# EAGLE design Adafruit ESP32-S3 Reverse TFT (EAGLE 9.6.2)
COMPANY: ADAFRUIT INDUSTRIES; DRAWN: KTOWN; REV: B
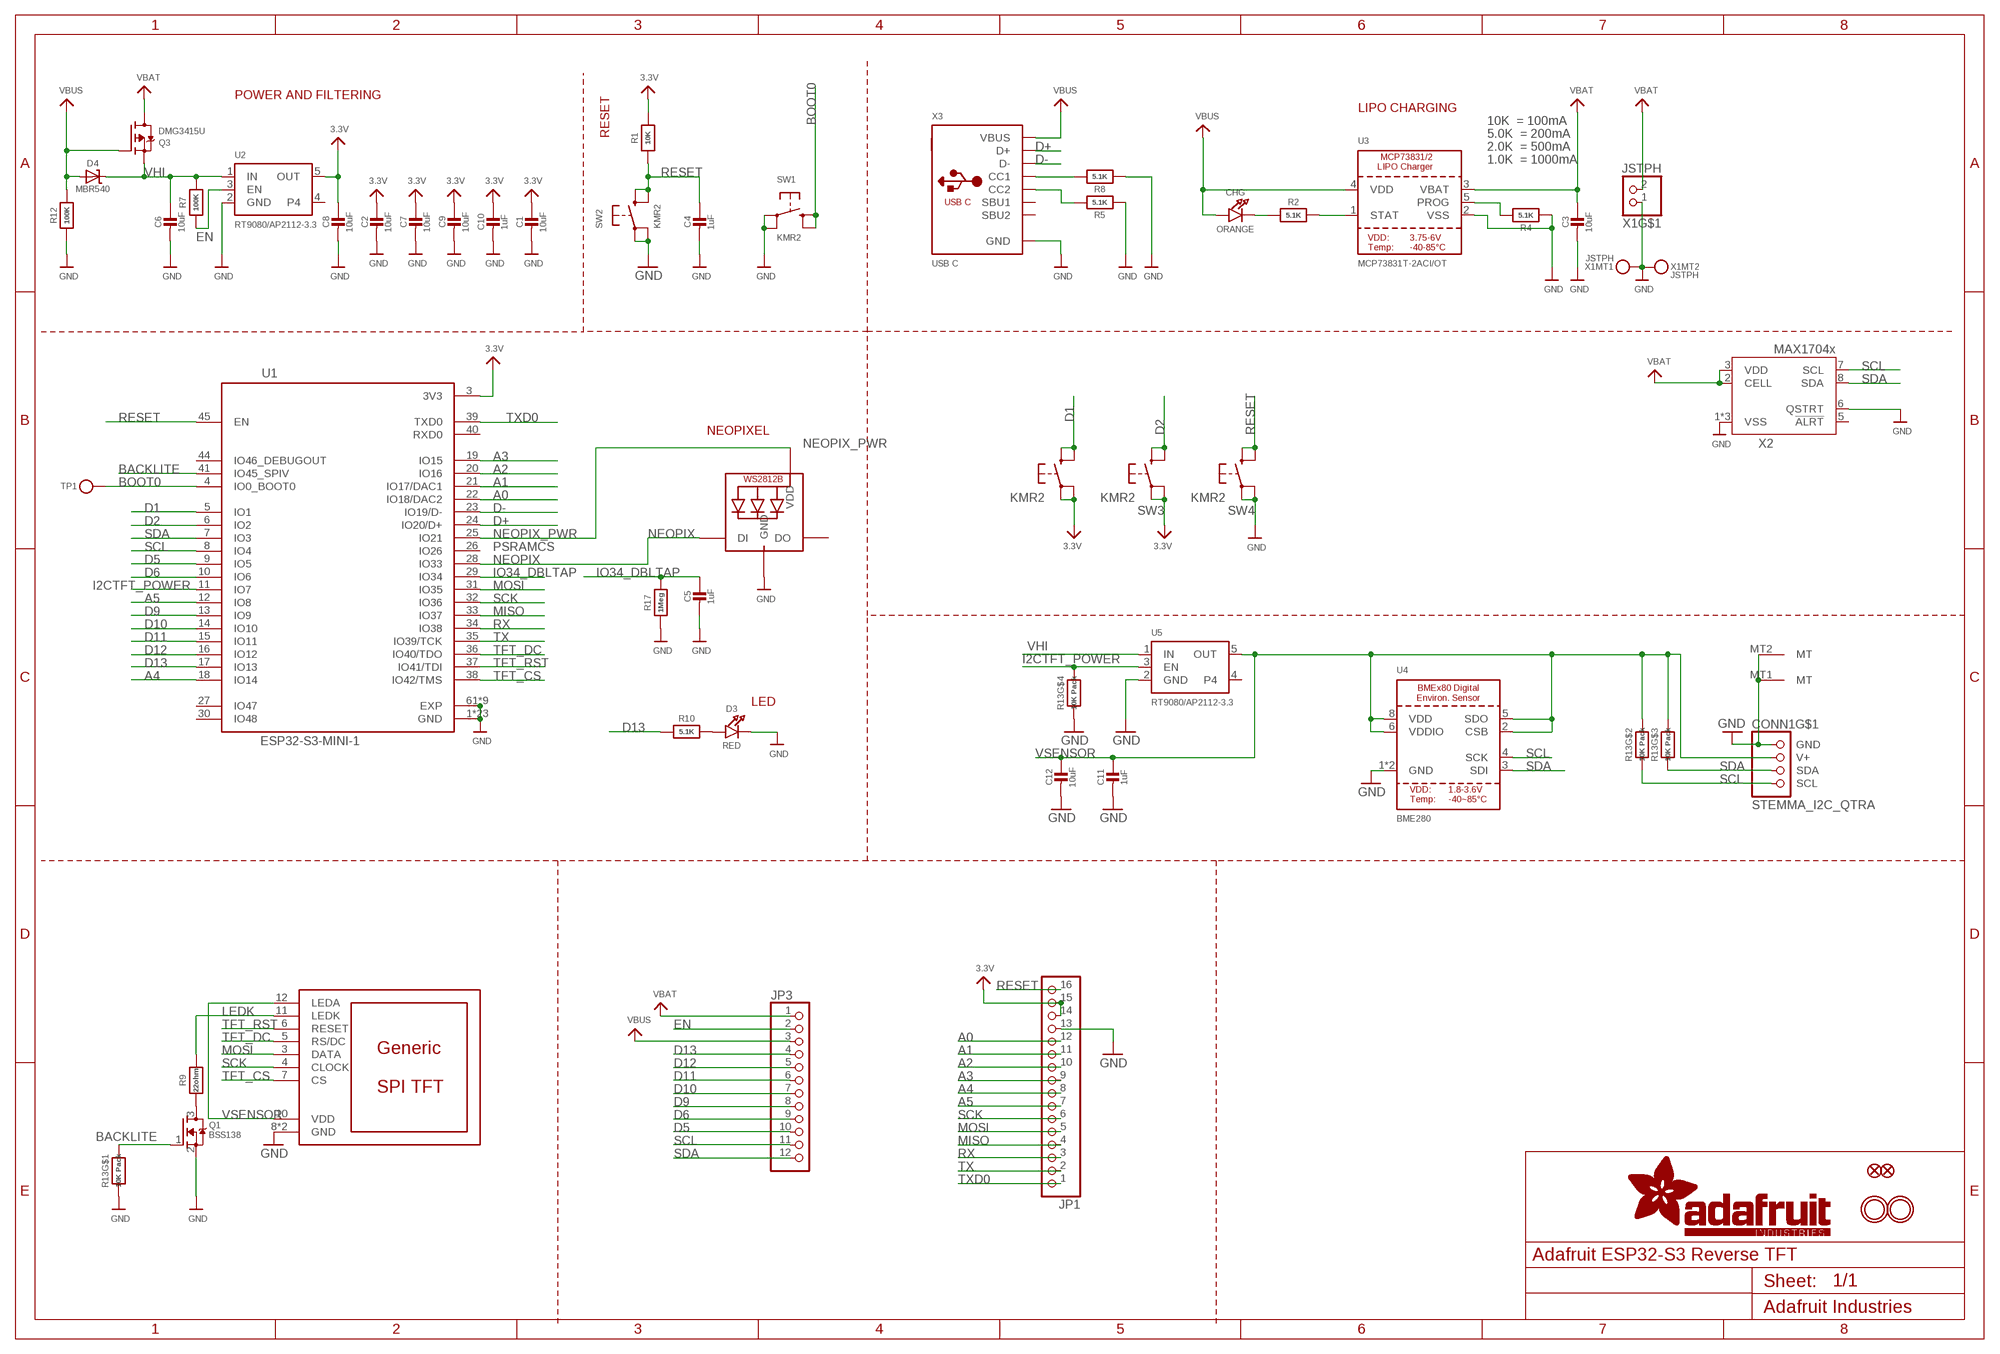
[diagram p0: schematic, sheet 1]

## Parts
C1  10uF  CAP_CERAMIC0805-NOOUTLINE  [0805-NO]
C2  10uF  CAP_CERAMIC0805-NOOUTLINE  [0805-NO]
C3  10uF  CAP_CERAMIC0805-NOOUTLINE  [0805-NO]
C4  1uF  CAP_CERAMIC0603_NO  [0603-NO]
C5  1uF  CAP_CERAMIC0603_NO  [0603-NO]
C6  10uF  CAP_CERAMIC0805-NOOUTLINE  [0805-NO]
C7  10uF  CAP_CERAMIC0805-NOOUTLINE  [0805-NO]
C8  10uF  CAP_CERAMIC0805-NOOUTLINE  [0805-NO]
C9  10uF  CAP_CERAMIC0805-NOOUTLINE  [0805-NO]
C10  1uF  CAP_CERAMIC0603_NO  [0603-NO]
C11  1uF  CAP_CERAMIC0603_NO  [0603-NO]
C12  10uF  CAP_CERAMIC0805-NOOUTLINE  [0805-NO]
CHG  ORANGE  LED0603_NOOUTLINE  [CHIPLED_0603_NOOUTLINE]
CONN1  STEMMA_I2C_QTRA  [JST_SH4_RA]
D3  RED  LED0603_NOOUTLINE  [CHIPLED_0603_NOOUTLINE]
D4  MBR540  DIODE-SCHOTTKYSOD-123  [SOD-123]
DISP1  DISP_LCD_GENERIC_SPI_1.14IN_240X135_WRAPUNDER  [TFT_1.14IN_240X135_WRAPUNDER]
JP1  HEADER-1X16_MIN  [1X16_ROUND_MIN]
JP3  HEADER-1X12_MIN  [1X12_ROUND_MIN]
LED1  WS2812B_SK6805_1515  [SK6805_1515]
Q1  BSS138  MOSFET-N_SC70  [SC70]
Q3  DMG3415U  MOSFET-P  [SOT23-R]
R1  10K  RESISTOR_0603_NOOUT  [0603-NO]
R2  5.1K  RESISTOR_0603_NOOUT  [0603-NO]
R4  5.1K  RESISTOR_0603_NOOUT  [0603-NO]
R5  5.1K  RESISTOR_0603_NOOUT  [0603-NO]
R7  100K  RESISTOR_0603_NOOUT  [0603-NO]
R8  5.1K  RESISTOR_0603_NOOUT  [0603-NO]
R9  22ohm  RESISTOR_0603_NOOUT  [0603-NO]
R10  5.1K  RESISTOR_0603_NOOUT  [0603-NO]
R12  100K  RESISTOR_0603_NOOUT  [0603-NO]
R13  10K Pack  RESISTOR_4PACK  [RESPACK_4X0603]
R17  1Meg  RESISTOR_0603_NOOUT  [0603-NO]
SW1  KMR2  SWITCH_TACT_SMT_RKB2  [BTN_RKB2_4.6X2.8]
SW2  KMR2  SWITCH_TACT_SMT_RKB2  [BTN_RKB2_4.6X2.8]
SW3  KMR2  SWITCH_TACT_SMT_RKB2  [BTN_RKB2_4.6X2.8]
SW4  KMR2  SWITCH_TACT_SMT_RKB2  [BTN_RKB2_4.6X2.8]
SW5  KMR2  SWITCH_TACT_SMT_RKB2  [BTN_RKB2_4.6X2.8]
TP1  TESTPOINTROUND1.5MMNO  [TESTPOINT_ROUND_1.5MM_NO]
U1  ESP32-S3-MINI-1  [ESP32-S2-MINI-1]
U2  RT9080/AP2112-3.3  VREG_SOT23-5  [SOT23-5]
U3  MCP73831T-2ACI/OT  MCP73831/2  [SOT23-5]
U4  BME280  [BME280]
U5  RT9080/AP2112-3.3  VREG_SOT23-5  [SOT23-5]
U$31  MOUNTINGHOLE2.5  [MOUNTINGHOLE_2.5_PLATED]
U$32  MOUNTINGHOLE2.5  [MOUNTINGHOLE_2.5_PLATED]
U$34  FIDUCIAL_1MM  [FIDUCIAL_1MM]
U$35  FIDUCIAL_1MM  [FIDUCIAL_1MM]
X1  JSTPH  CON_JST_PH_2PIN_MT_BATT  [JSTPH2_BATT]
X2  MAX17048/T  [TDFN8_2X2MM]
X3  USB C  USB_C  [USB_C_CUSB31-CFM2AX-01-X]

## Nets
3.3V: C1.1 C2.1 C7.1 C8.1 C9.1 C10.1 JP1.14 JP1.15 R1.2 SW3.A'(P1) SW3.A(P) SW5.A'(P1) SW5.A(P) U1.3(3V3) U2.5(OUT)
A0: JP1.12 U1.22(IO18/DAC2)
A1: JP1.11 U1.21(IO17/DAC1)
A2: JP1.10 U1.20(IO16)
A3: JP1.9 U1.19(IO15)
A4: JP1.8 U1.18(IO14)
A5: JP1.7 U1.12(IO8)
BACKLITE: Q1.1(G) R13.8 U1.41(IO45_SPIV)
BOOT0: SW1.B'(S1) SW1.B(S) TP1.P$1 U1.4(IO0_BOOT0)
D1: SW5.B'(S1) SW5.B(S) U1.5(IO1)
D2: SW3.B'(S1) SW3.B(S) U1.6(IO2)
D5: JP3.10 U1.9(IO5)
D6: JP3.9 U1.10(IO6)
D9: JP3.8 U1.13(IO9)
D10: JP3.7 U1.14(IO10)
D11: JP3.6 U1.15(IO11)
D12: JP3.5 U1.16(IO12)
D13: JP3.4 R10.1 U1.17(IO13)
D+: U1.24(IO20/D+) X3.A6(D+) X3.B6(D+)
D-: U1.23(IO19/D-) X3.A7(D-) X3.B7(D-)
EN: JP3.2 R7.1 U2.3(EN)
GND: C1.2 C2.2 C3.2 C4.2 C5.2 C6.2 C7.2 C8.2 C9.2 C10.2 C11.2 C12.2 CONN1.1(GND) CONN1.MT1(MT) CONN1.MT2(MT) D3.C DISP1.8(GND) DISP1.13(GND) JP1.13 LED1.4(GND) Q1.2(S) R4.1 R5.1 R8.1 R12.1 R13.1 R13.4 R17.1 SW1.A'(P1) SW1.A(P) SW2.A'(P1) SW2.A(P) SW4.A'(P1) SW4.A(P) U1.1(GND) U1.2(GND) U1.42(GND) U1.43(GND) U1.46(GND) U1.47(GND) U1.48(GND) U1.49(GND) U1.50(GND) U1.51(GND) U1.52(GND) U1.53(GND) U1.54(GND) U1.55(GND) U1.56(GND) U1.57(GND) U1.58(GND) U1.59(GND) U1.60(GND) U1.61(EXP) U1.62(GND) U1.63(GND) U1.64(GND) U1.65(GND) U1.66(EXP) U1.67(EXP) U1.68(EXP) U1.69(EXP) U1.70(EXP) U1.71(EXP) U1.72(EXP) U1.73(EXP) U2.2(GND) U3.2(VSS) U4.1(GND) U4.7(GND) U5.2(GND) X1.1 X1.NC1 X1.NC2 X2.1(VSS) X2.4(VSS) X2.6(QSTRT) X2.THERMAL(VSS) X3.A1B12(GND) X3.B1A12(GND)
I2CTFT_POWER: R13.5 U1.11(IO7) U5.3(EN)
IO34_DBLTAP: C5.1 R17.2 U1.29(IO34)
LEDK: DISP1.11(LEDK) R9.2
MISO: JP1.4 U1.33(IO37)
MOSI: DISP1.3(DATA) JP1.5 U1.31(IO35)
N$1: CHG.C R2.1
N$2: Q1.3(D) R9.1
N$3: R2.2 U3.1(STAT)
N$4: R4.2 U3.5(PROG)
N$5: D3.A R10.2
N$8: R8.2 X3.A5(CC1)
N$9: R5.2 X3.B5(CC2)
NEOPIX: LED1.1(DI) U1.28(IO33)
NEOPIX_PWR: LED1.2(VDD) U1.25(IO21)
RESET: C4.1 JP1.16 R1.1 SW2.B'(S1) SW2.B(S) SW4.B'(S1) SW4.B(S) U1.45(EN)
RX: JP1.3 U1.34(IO38)
SCK: DISP1.4(CLOCK) JP1.6 U1.32(IO36)
SCL: CONN1.4(SCL) JP3.11 R13.2 U1.8(IO4) U4.4(SCK) X2.7(SCL)
SDA: CONN1.3(SDA) JP3.12 R13.3 U1.7(IO3) U4.3(SDI) X2.8(SDA)
TFT_CS: DISP1.7(CS) U1.38(IO42/TMS)
TFT_DC: DISP1.5(RS/DC) U1.36(IO40/TDO)
TFT_RST: DISP1.6(RESET) U1.37(IO41/TDI)
TX: JP1.2 U1.35(IO39/TCK)
TXD0: JP1.1 U1.39(TXD0)
VBAT: C3.1 JP3.1 Q3.3(D) U3.3(VBAT) X1.2 X2.2(CELL) X2.3(VDD)
VBUS: CHG.A D4.A JP3.3 Q3.1(G) R12.2 U3.4(VDD) X3.A4B9(VBUS) X3.B4A9(VBUS)
VHI: C6.1 D4.C Q3.2(S) R7.2 U2.1(IN) U5.1(IN)
VSENSOR [Power]: C11.1 C12.1 CONN1.2(V+) DISP1.10(VDD) DISP1.12(LEDA) R13.6 R13.7 U4.2(CSB) U4.5(SDO) U4.6(VDDIO) U4.8(VDD) U5.5(OUT)
Unconnected: LED1.3(DO) U1.26(IO26) U1.27(IO47) U1.30(IO48) U1.40(RXD0) U1.44(IO46_DEBUGOUT) U2.4 U5.4 X2.5(!ALRT) X3.A8(SBU1) X3.B8(SBU2)

## Notes on the sheet
- POWER AND FILTERING
- LIPO CHARGING
- 10K  = 100mA
- RESET | 5.0K  = 200mA
- 2.0K  = 500mA
- 1.0K  = 1000mA
- NEOPIXEL
- PSRAMCS
- LED

## Library data of the parts
C1-C12 = microbuilder:CAP_CERAMIC: Ceramic Capacitors For new designs, use the packages preceded by an '_' character since they are more reliable: The following footprints should be used on most boards: _0402 - Standard footprint for regular board layouts _0603 - Standard footprint for regular board layouts _0805 - Standard footprint for regular board layouts _1206 - Standard footprint for regular board layouts For extremely tight-pitch boards where space is at a premium, the following 'micro-pitch' footprints can be used (smaller pads, no silkscreen outline, etc.): _0402MP - Micro-pitch footprint for very dense/compact boards _0603MP - Micro-pitch footprint for very dense/compact boards _0805MP - Micro-pitch footprint for very dense/compact boards _1206MP - Micro-pitch footprint for very dense/compact boards
CHG D3 = microbuilder:LED: LED 0603 - 0603 Surface Mount Package 2mA: Green LED - Low Power (3.9mcd, 2ma, 1.7Vf) - Digikey: 475-2709-2-ND Orange LED - Low Power (9.8mcd, 2ma, 1.8Vf) - Digikey: 475-1194-2-ND Red LED - Low Power (5mcd, 2ma, 1.8Vf) - Digikey: 475-1195-2-ND Yellow LED - Low Power (7mcd, 2ma, 1.8Vf) - Digikey: 475-1196-2-ND 5mA: Blue LED - Low Power (17mcd, 5ma, 2.9Vf) - Digikey: LNJ937W8CRACT-ND 0805 - 0805 Surface Mount Package 2mA: Red LED (8.8mcd, 2mA, 1.8Vf, Clear) - Low Power [Digikey: 475-2510-1-ND] Green LED (5mcd, 2mA, 1.8Vf, Clear) - Low Power [Digikey: 475-2730-1-ND] Yellow LED (11.3mcd, 2mA, 1.8Vf, Clear) - Low Power [Digikey: 475-2555-1-ND] 20mA: Red LED (104mcd, 20mA, Diffused) - LS R976 [Digikey: 475-1278-6-ND] Red LED (12mcd, 20mA, 2.0Vf, Clear) - APT2012EC [Digikey: 754-1128-1-ND] Green LED (15mcd, 20mA, 2.2Vf, Clear) - APT2012GC [Digikey: 754-1131-1-ND] Orange LED (160mcd, 20mA, 2.1Vf, Clear) - APT2012SECK [Digikey: 754-1130-1-ND] 1206 - 1206 Surface Mount Package Green LED (26mcd, 20mA, Diffused) - LG N971 [Digikey: 475-1407-6-ND] Red LED (15mcd, 20mA, Diffused) - LH N974 [Digikey: 475-1416-6-ND] Cree - Cree High-Power Surface Mount LEDs XPEBWT-L1-0000-00D50 - White 111lm 350mA 2.9Vf 6200K 110° XTEAWT-00-0000-00000LEE3 - White 114lm 350mA 2.85Vf 5000K 115° Everlight - Everlight 45-21 Series Surface Mount LEDs 45-21/QK2C-B2832AC2CB2/2T - Warm White 2000mcd 20mA 3.25Vf 3050K 120° 45-21/LK2C-B38452C4CB2/2T - Nuetral White 2000mcd 20mA 3.25Vf 4150K 120° 45-21/LK2C-B50634C6CB2/2T - Cold White 2200mcd 20mA 3.25Vf 5650K 120° PLCC2 Reverse Mount LS T77K-J1L2-1-0-2-R18-Z - Red 11.25mcd 2mA 1.8Vf 630nm 120° LO T77K-L1M2-24-Z - Orange 19.6mcd 2mA 1.8Vf 606nm 120° LY T77K-K2M1-26-Z - Yellow 15.7mcd 2mA 1.8Vf 587nm 120°; ROT: 270
CONN1 = adafruit_electromech:STEMMA_I2C; LCSC: C145961
D4 = microbuilder:DIODE-SCHOTTKY
DISP1 = adafruit_display:DISP_LCD_GENERIC_SPI
JP1 = microbuilder:HEADER-1X16: PIN HEADER
JP3 = microbuilder:HEADER-1X12
LED1 = microbuilder:WS2812B; LCSC: C2890035
Q1 = microbuilder:MOSFET-N: N-Channel Mosfet LEGEND VDS: Voltage Drain-Source ID: Drain Current RDS(ON): Drain-Source On-State Resistance VGS(TH): Gate-Source Threshold Voltage CISS: Drain-Source Input Capacitance SOT-23 Name VDS ID RDS(ON) VGS(TH) CISS Order Number 2N7002E 60V 260mA 2.5 Ohm 2.5V @ 250uA 26.7pF @ 25V 2N7002ET1GOSTR-ND BSH103 30V 850mA 400 mOhm 400mV @ 1mA 83pF @ 24V BSH103,235-ND BSS138 60V 320mA 1.6 Ohm 1.5V @ 250uA 50pF @ 10V Mouser: 771-BSS138PW115 DMN2075U-7 20V 4.2A 38 mOhm 1V @ 250 uA 594.3pF @ 10V DMN2075U-7DICT-ND * BSS138 good choice for I2C level-shifting POWERPAK 1212-8 Name VDS ID RDS(ON) VGS(TH) CISS Order Number Si7308DN 60V 6A 58 mOhm 3V @ 250uA 665pF @ 15V SI7308DN-T1-E3CT-ND
Q3 = microbuilder:MOSFET-P: P-Channel Mosfet LEGEND VDS: Voltage Drain-Source ID: Drain Current RDS(ON): Drain-Source On-State Resistance VGS(TH): Gate-Source Threshold Voltage CISS: Drain-Source Input Capacitance SOT-23 Name VDS ID RDS(ON) VGS(TH) CISS Order Number IRLML5103 30V 760mA 600 mOhm -- 75pF @ 25V Digikey: IRLML5103PBFCT-ND IRLML6401 12V 4.3A 50 mOhm 950mV @ 250µA 830pF @ 10V Digikey: IRLML6401PBFTR-ND NTR0202PL 20V 400mA 800 mOhm 2.3V @ 250uA 70pF @ 5V Digikey: NTR0202PLT1GOSTR-ND NTR4101PT1G 20V 1.8A 85 mOhm 1.2V @ 250uA 675pF @ 10V Digikey: NTR4101PT1GOSCT-ND DMP2004K 20V 600mA 900 mOhm 1V @ 250uA 175pF @ 16V Digikey: DMP2004KDICT-ND PMV65XP 20V 3.9A 76 mOhm 950mV @ 1mA 725pF @ 20V Digikey: 568-2358-2-ND TO-252 Name VDS ID RDS(ON) VGS(TH) CISS Order Number AOD417 30V 25A 34 mOhm 3V @ 250µA 920pF @ 15V Digikey: 785-1106-2-ND PowerPak Name VDS ID RDS(ON) VGS(TH) CISS Order Number AON7401 30V 12A 14 mOhm 3V @ 250µA 2600pF @ 15V Digikey: 785-1302-1-ND
R1 R2 R4 R5 R7-R10 R12 R17 = microbuilder:RESISTOR: Resistors For new designs, use the packages preceded by an '_' character since they are more reliable: The following footprints should be used on most boards: _0402 - Standard footprint for regular board layouts _0603 - Standard footprint for regular board layouts _0805 - Standard footprint for regular board layouts _1206 - Standard footprint for regular board layouts For extremely tight-pitch boards where space is at a premium, the following 'micro-pitch' footprints can be used (smaller pads, no silkscreen outline, etc.): _0402MP - Micro-pitch footprint for very dense/compact boards _0603MP - Micro-pitch footprint for very dense/compact boards _0805MP - Micro-pitch footprint for very dense/compact boards _1206MP - Micro-pitch footprint for very dense/compact boards
R13 = microbuilder:RESISTOR_4PACK: Resistor Packs (4 resistors) 4 x 0603 10K 1/16W - Digikey: YC164J-10KCT-ND
SW1-SW5 = adafruit_electromech:SWITCH_TACT_SMT: SMT Tact Switches RKB2 https://www.digikey.com/short/m027prz5
TP1 = microbuilder:TESTPOINT: Test Point Various test points for characterisation and PCB testing TESTPOINT_SMT - Compact Surface Mount Test Point [Digikey: 5016KTR-ND]
U1 = adafruit_wireless:ESP32-S3-MINI-1; BUILT_BY: EMA_Kyle; COPYRIGHT: Copyright (C) 2018 Accelerated Designs. All rights reserved; DATASHEET: https://www.espressif.com/sites/default/files/documentation/esp32-s2-mini-1_esp32-s2-mini-1u_datasheet_en.pdf; MANUFACTURER_PART_NUMBER: ESP32-S2-MINI-1; SOURCELIBRARY: Add_to_database_2020-11-03; VENDOR: Espressif Systems
U2 U5 = adafruit_power:VREG_SOT23-5: SOT23-5 Fixed Voltage Regulators Part Current Out V Out V In V Dropout θJA (°C/W) TJ (°C) Digikey Part No. ADP121 150mA 3.3V 3.4-5.5V 0.09V @ 150mA -- -- ADP121-AUJZ33R7CT-ND ADP121 150mA 3.0V 3.1-5.5V 0.09V @ 150mA -- -- ADP121-AUJZ30R7CT-ND ADP122 300mA 3.3V 3.4-5.5V 0.085V @ 300mA -- -- ADP122AUJZ-3.3-R7CT-ND ADP1712 300mA 3.3V 3.5-5.5V 0.17V @ 300mA -- -- ADP1712AUJZ-3.3-R7TR-ND AP7311 (Low Cost) 150mA 3.3V 3.5-6V 0.15V @ 150mA -- -- AP7311-33WG-7DICT-ND LD39015M18R 150mA 1.8V 1.9V-5.5V 0.08V @ 100mA -- -- 497-6977-1-ND LP2985A-33DBVR 150mA 3.3V 3.3-16V 0.28V @ 150mA 206 150 296-18479-1-ND MCP1824T-3302E/OT 300mA 3.3V 3.5V-6V 0.2V @ 300mA -- -- MCP1824T-3302E/OTCT-ND MIC5205-2.5YM5 TR 150mA 2.5V 2.7-16V 0.165V @ 150mA -- -- 576-1257-2-ND MIC5205-3.0YM5 TR 150mA 3.0V 3.2V-16V 0.165V @ 150mA -- -- 576-1258-2-ND MIC5205-3.3YM5 TR 150mA 3.3V 3.5V-16V 0.165V @ 150mA -- -- 576-1259-2-ND TPS780330220 150mA 3.3V+2.2V 3.6-5.5V 250mV Max -- -- 296-23332-1-ND TDA3663/N1,135 100mA 3.3V 3.5-45V 0.18V @ 50mA -- -- 568-5343-1-ND Max operating temp can be calculated using θJA, TJ (max junction temperature), and power in watts. Set the "Maximum Ambient Temperature" until it reaches TJ ("Max Junction Temperature"), which is the absolute limit for safe use of the regulator: Heat Sink Temperature Calculator <http://www.daycounter.com/Calculators/Heat-Sink-Temperature-Calculator.phtml> For example, With 12V source into a 3.3V LP2985 and a 30mA load, we are dissipating (12V-3.3V) * 0.03A = 0.261W. With a θJA of 206 °C/W, a TJ of 150°C, and 261mW we can safely use the chip without a heat sink up to 75°C (=147.1°C Junction Temperature).; JLC_ROTATION: 0
U3 = microbuilder:MCP73831/2: MCP73831/2 LIPO Charger VDD: 3.75 - 6V Temp -40 - 85°C Programmable Charge Rate: 15-500mA NOTE: STAT is a tri-state logic output on the MCP73831 and an open-drain output on the MCP73832. SOT23-5 with 4.2V output and tri-state logic on STAT = MCP73831T-2ACI/OT; JLC_ROTATION: 270; LCSC: C424093
U4 = adafruit_sensor:BME280: BME280 - Environmental Sensor (I2C + SPI); ROT: 180
U$31 U$32 = adafruit_electromech:MOUNTINGHOLE: Mounting Hole For #2 screws (0.086"/2.18mm width, 0.094"/2.4mm hole) use 2.5mm; BOM: EXCLUDE
U$34 U$35 = microbuilder:FIDUCIAL: Fiducial Alignment Points Various fiducial points for machine vision alignment.; BOM: EXCLUDE
X1 = adafruit_electromech:CON_JST_PH_2PIN_MT; LCSC: C47647
X2 = adafruit_sensor:MAX17048; ROT: 270
X3 = adafruit_electromech:USB_C: USB Type-C USB 2.0 Connector; LCSC: C165948

## Net classes
2 gnd: width 0.254 mm, drill 0.483 mm
3 Power: width 0.305 mm, drill 0.483 mm

## Board
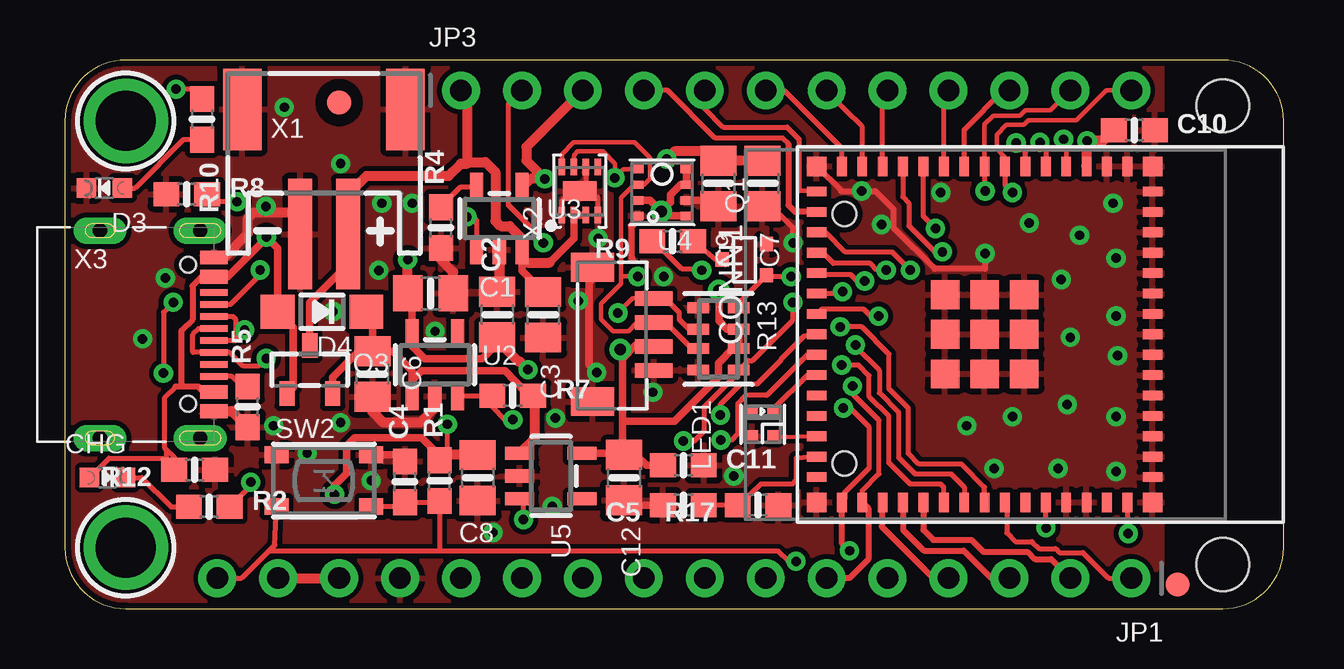
[diagram p1: board, top side]
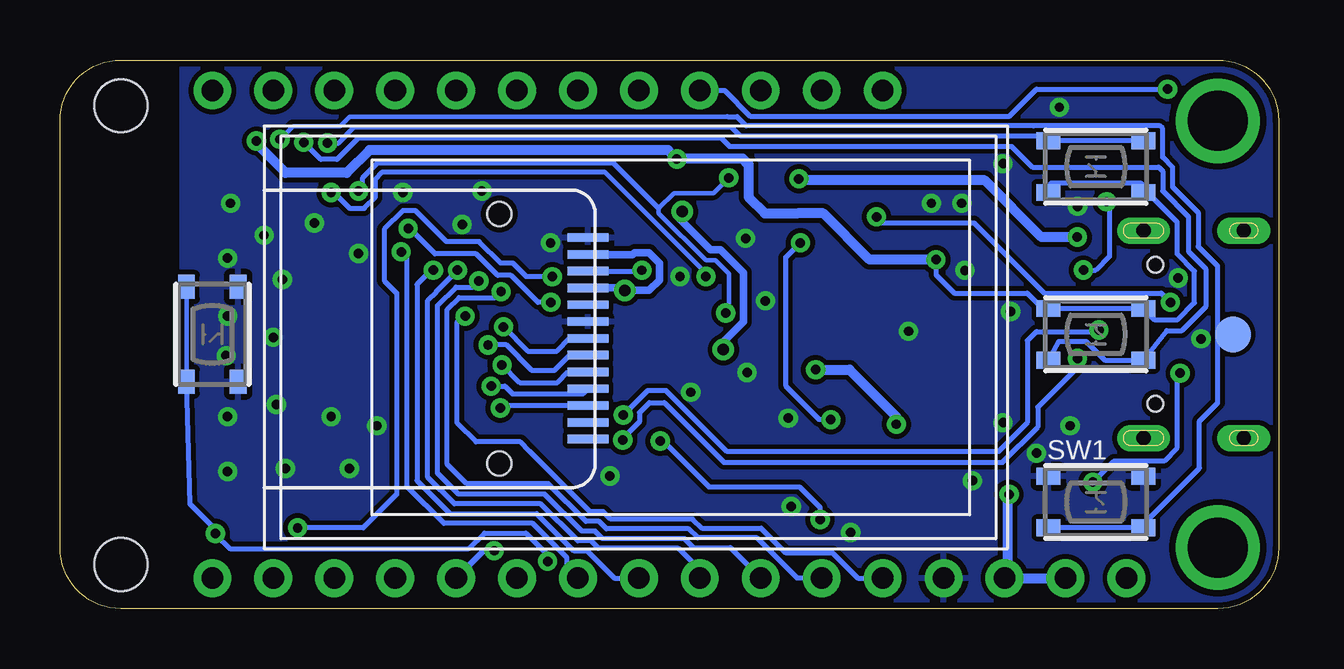
[diagram p2: board, bottom side, seen from below]

Size 50.8 x 22.86 mm. Coordinates in mm from the lower left corner, seen from the top.
Outline: 2.54,0 48.26,0 arc90 50.8,2.54 50.8,20.32 arc90 48.26,22.86 2.54,22.86 arc90 0,20.32 0,2.54 arc90 2.54,0
Copper layers (1*16): Top 0.035mm / dielectric 1.5mm / Bottom 0.035mm
Design rules "adafruit 7-7 *": minimum track width 6mil, minimum drill 15.5mil, track to track 8mil, track to pad 7mil, pad to pad 7mil, via to via 7mil, smd to smd 7mil, copper to edge 10mil, drill to drill 8mil, minimum pad ring 10mil, minimum via ring 8mil, stop-mask expansion 2mil, vias tented up to drill 20mil, thermal gap 10mil
Holes 2.2 mm at 48.26,1.84 48.26,20.95

### Footprints (pad centres in the part's own frame; a part is rotated, then mirrored left to right if it is on the bottom)
0805-NO = smd 1.24 x 1.5: 1 -0.95,0; 2 0.95,0
0603-NO = smd 1.075 x 1: 1 -0.85,0; 2 0.85,0
CHIPLED_0603_NOOUTLINE = smd 0.8 x 0.8: A 0,-0.75; C 0,0.75
JST_SH4_RA = smd 0.6 x 1.55: 1 1.5,0.924; 2 0.5,0.924; 3 -0.5,0.924; 4 -1.5,0.924 | smd 1.2 x 1.8: MT1 -2.8,-1.624; MT2 2.8,-1.624
SOD-123 = smd 1.4 x 1.4: A 1.85,0; C -1.85,0
TFT_1.14IN_240X135_WRAPUNDER = smd 0.35 x 1.7: 1 4.24,13.5; 2 3.54,13.5; 3 2.84,13.5; 4 2.14,13.5; 5 1.44,13.5; 6 0.74,13.5; 7 0.04,13.5; 8 -0.66,13.5; 9 -1.36,13.5; 10 -2.06,13.5; 11 -2.76,13.5; 12 -3.46,13.5; 13 -4.16,13.5 | hole 1: -5.14,9.8; 5.26,9.8
1X16_ROUND_MIN = drill 0.9 pad 1.575: 1 -19.05,0; 2 -16.51,0; 3 -13.97,0; 4 -11.43,0; 5 -8.89,0; 6 -6.35,0; 7 -3.81,0; 8 -1.27,0; 9 1.27,0; 10 3.81,0; 11 6.35,0; 12 8.89,0; 13 11.43,0; 14 13.97,0; 15 16.51,0; 16 19.05,0
1X12_ROUND_MIN = drill 0.9 pad 1.575: 1 -13.97,0; 2 -11.43,0; 3 -8.89,0; 4 -6.35,0; 5 -3.81,0; 6 -1.27,0; 7 1.27,0; 8 3.81,0; 9 6.35,0; 10 8.89,0; 11 11.43,0; 12 13.97,0
SK6805_1515 = smd 0.5 x 0.5: 1 -0.5,-0.45; 2 0.5,-0.45; 3 0.5,0.45; 4 -0.5,0.45
SC70 = smd 0.6 x 0.55: 1 -0.65,-0.925; 2 0.65,-0.925; 3 0,0.925
SOT23-R = smd 0.635 x 1.016: 1 -0.95,-1; 2 0.95,-1; 3 0,1
RESPACK_4X0603 = smd 0.45 x 0.9: 1 -1.3,-0.85; 2 -0.4,-0.85; 3 0.4,-0.85; 4 1.3,-0.85; 5 1.3,0.85; 6 0.4,0.85; 7 -0.4,0.85; 8 -1.3,0.85
BTN_RKB2_4.6X2.8 = smd 1 x 0.7: A 1.973,1.075; A' -1.973,1.075; B 1.973,-1.075; B' -1.973,-1.075
TESTPOINT_ROUND_1.5MM_NO = smd 1.5 x 1.5: P$1 0,0
ESP32-S2-MINI-1 = smd 0.813 x 0.406: 1 -7,5.931; 2 -7,5.081; 3 -7,4.231; 4 -7,3.381; 5 -7,2.531; 6 -7,1.681; 7 -7,0.831; 8 -7,-0.019; 9 -7,-0.869; 10 -7,-1.719; 11 -7,-2.569; 12 -7,-3.419; 13 -7,-4.269; 14 -7,-5.119; 15 -7,-5.969; 31 7,-5.969; 32 7,-5.119; 33 7,-4.269; 34 7,-3.419; 35 7,-2.569; 36 7,-1.719; 37 7,-0.869; 38 7,-0.019; 39 7,0.831; 40 7,1.681; 41 7,2.531; 42 7,3.381; 43 7,4.231; 44 7,5.081; 45 7,5.931 | smd 0.406 x 0.813: 16 -5.95,-7.019; 17 -5.1,-7.019; 18 -4.25,-7.019; 19 -3.4,-7.019; 20 -2.55,-7.019; 21 -1.7,-7.019; 22 -0.85,-7.019; 23 0,-7.019; 24 0.85,-7.019; 25 1.7,-7.019; 26 2.55,-7.019; 27 3.4,-7.019; 28 4.25,-7.019; 29 5.1,-7.019; 30 5.95,-7.019; 46 5.95,6.981; 47 5.1,6.981; 48 4.25,6.981; 49 3.4,6.981; 50 2.55,6.981; 51 1.7,6.981; 52 0.85,6.981; 53 0,6.981; 54 -0.85,6.981; 55 -1.7,6.981; 56 -2.55,6.981; 57 -3.4,6.981; 58 -4.25,6.981; 59 -5.1,6.981; 60 -5.95,6.981 | smd 1.194 x 1.194: 61 0,-0.019; 66 -1.65,1.631; 67 0,1.631; 68 1.65,1.631; 69 -1.65,-0.019; 70 1.65,-0.019; 71 -1.65,-1.669; 72 0,-1.669; 73 1.65,-1.669 | smd 0.813 x 0.813: 62 -7,6.981; 63 -7,-7.019; 64 7,-7.019; 65 7,6.981
SOT23-5 = smd 0.55 x 1.2: 1 -0.95,-1.3; 2 0,-1.3; 3 0.95,-1.3; 4 0.95,1.3; 5 -0.95,1.3
BME280 = smd 0.5 x 0.35: 1 1.025,0.975; 2 1.025,0.325; 3 1.025,-0.325; 4 1.025,-0.975; 5 -1.025,-0.975; 6 -1.025,-0.325; 7 -1.025,0.325; 8 -1.025,0.975
MOUNTINGHOLE_2.5_PLATED = drill 2.5 pad 3.2: P$1 0,0
FIDUCIAL_1MM = smd 1 x 1: 1 0,0
JSTPH2_BATT = smd 1 x 4.6: 1 -1,-2.049; 2 1,-2.049 | smd 1.6 x 3.4: NC1 -3.4,3.151; NC2 3.4,3.151
TDFN8_2X2MM = smd 0.7 x 0.275: 1 -1,0.75; 2 -1,0.25; 3 -1,-0.25; 4 -1,-0.75; 5 1,-0.75; 6 1,-0.25; 7 1,0.25; 8 1,0.75 | smd 0.8 x 1.38: THERMAL 0,0
USB_C_CUSB31-CFM2AX-01-X = smd 0.575 x 1.15: A1B12 -3.2,2.275; A4B9 -2.4,2.275; B1A12 3.2,2.275; B4A9 2.4,2.275 | smd 0.275 x 1.15: A5 -1.25,2.275; A6 -0.25,2.275; A7 0.25,2.275; A8 1.25,2.275; B5 1.75,2.275; B6 0.75,2.275; B7 -0.75,2.275; B8 -1.75,2.275 | drill 0.6 pad 1 long: M1 -4.32,1.7; M2 4.32,1.7; M3 -4.32,-2.48; M4 4.32,-2.48 | hole 0.65: 2.89,1.2; -2.89,1.2

### Placement (x,y rotation side)
C1  15.24,13.13 0 top
C2  18.02,12.26 90 top
C3  19.94,12.24 270 top
C4  14.17,5.28 90 top
C5  25.78,4.32 180 top
C6  12.82,9.77 270 top
C7  29.08,17.72 270 top
C8  17.21,5.45 270 top
C9  27.24,17.72 270 top
C10  44.58,19.94 0 top
C11  25.78,5.97 0 top
C12  23.3,5.46 270 top
CHG  1.78,5.46 270 top
CONN1  23.62,11.43 270 top
D3  1.65,17.53 90 top
D4  10.72,12.37 180 top
DISP1  42.29,11.3 270 bottom
JP1  25.4,1.27 180 top
JP3  30.48,21.59 0 top
LED1  29.08,7.68 90 top
PLABEL0  [PLABEL0]  21.59,20.07 0 top
PLABEL1  [PLABEL1]  6.35,2.92 0 top
PLABEL2  [PLABEL2]  11.56,2.79 0 top
PLABEL3  [PLABEL3]  9.02,2.79 0 top
PLABEL4  [PLABEL4]  19.18,2.79 0 top
PLABEL5  [PLABEL5]  16.76,2.79 0 top
PLABEL6  [PLABEL6]  24.13,20.07 0 top
PLABEL7  [PLABEL7]  31.75,2.79 0 top
PLABEL8  [PLABEL8]  34.29,2.79 0 top
PLABEL9  [PLABEL9]  36.83,2.79 0 top
PLABEL10  [PLABEL10]  39.37,2.79 0 top
PLABEL11  [PLABEL11]  41.78,2.79 0 top
PLABEL12  [PLABEL12]  16.51,20.07 0 top
PLABEL13  [PLABEL13]  14.1,2.79 0 top
PLABEL14  [PLABEL14]  5.33,18.41 0 top
PLABEL15  [PLABEL15]  19.05,20.07 0 top
PLABEL16  [PLABEL16]  44.51,2.79 0 top
PLABEL17  [PLABEL17]  21.69,2.74 0 top
PLABEL18  [PLABEL18]  29.21,2.79 0 top
PLABEL19  [PLABEL19]  45.91,21.59 90 top
PLABEL20  [PLABEL20]  24.23,2.77 0 top
PLABEL21  [PLABEL21]  26.8,2.79 0 top
PLABEL22  [PLABEL22]  10.67,7.62 0 top
PLABEL23  [PLABEL23]  26.67,20.07 0 top
PLABEL24  [PLABEL24]  29.21,20.07 0 top
PLABEL25  [PLABEL25]  31.75,20.07 0 top
PLABEL26  [PLABEL26]  34.29,20.07 0 top
PLABEL27  [PLABEL27]  36.83,20.07 0 top
PLABEL28  [PLABEL28]  39.37,20.07 0 top
PLABEL29  [PLABEL29]  41.91,20.07 0 top
PLABEL30  [PLABEL30]  29.65,10.22 90 top
PLABEL31  [PLABEL31]  25.08,7.68 0 top
PLABEL33  [PLABEL33]  4.19,17.84 90 bottom
PLABEL34  [PLABEL34]  4.25,11.43 90 bottom
PLABEL35  [PLABEL35]  4.06,5.4 90 bottom
PLABEL36  [PLABEL36]  45.02,6.41 90 bottom
PLABEL37  [PLABEL37]  48.26,11.43 90 bottom
Q1  28.32,14.54 90 top
Q3  10.21,9.96 0 top
R1  15.62,5.33 90 top
R2  6.02,4.24 0 top
R4  15.67,15.88 90 top
R5  7.62,8.41 90 top
R7  18.67,8.88 0 top
R8  5.08,17.27 0 top
R9  25.34,15.3 180 top
R10  5.71,20.38 270 top
R12  5.41,5.79 180 top
R13  27.24,11.24 270 top
R17  28.89,4.32 180 top
SW1  7.62,4.45 0 bottom
SW2  10.79,5.33 0 top
SW3  7.62,18.41 180 bottom
SW4  44.45,11.43 270 bottom
SW5  7.62,11.43 0 bottom
TP1  1.91,11.43 0 bottom
U1  38.35,11.43 270 top
U2  15.42,10.16 0 top
U3  18.11,16.26 0 top
U4  24.89,17.34 180 top
U5  20.26,5.52 270 top
U$31  2.54,20.32 270 top
U$32  2.54,2.54 270 top
U$34  11.43,21.08 270 top
U$35  46.38,1 270 top
X1  10.79,17.65 0 top
X2  21.46,17.4 90 top
X3  3.94,11.43 270 top

### Tracks (layer width: path | path; a pad name or v marks a point on that pad's centre or on a via)
3.3V  (via drill 0.39)
  Top 0.203: R1.2 15.94,6.5 v15.94,7.68
  Top 0.305: C1.1 14.47,12.95 U2.5 14.47,10.93 14.99,10.41 17.4,10.41 18.02,11.04 C2.1 | R1.2 15.62,6.38 14.87,7.13 12.08,7.13 11.75,6.79 11.75,5.65 11.24,5.14 v11.24,4.76
  Top 0.406: C1.1 v14.29,14.54 | C7.1 C9.1 26.99,18.67 26.61,19.05 25.4,19.05 v25.08,18.73 | JP1.15 JP1.14 | C8.1 15.84,6.4 R1.2 | C10.1 43.27,19.49 v42.61,19.49 42.61,19.36 42.57,19.32 42.57,18.45 U1.3 | v19.3,9.96 18.97,10.29 18.9,10.29 18.02,11.18 C2.1
  Bottom 0.203: SW3.A 9.52,17.72 5.72,17.72 SW3.A' 5.62,17.49 4.23,16.1 4.23,14.78 3.51,14.06 3.51,12.74 4.22,12.04 5.18,12.04 SW5.A SW5.A' 9.62,12.29 10.48,13.14 13.53,13.14 14.29,13.91 v14.29,14.54
  Bottom 0.406: v11.24,4.76 11.3,4.7 11.3,1.4 JP1.14 JP1.15 | v42.61,19.49 42.61,19.37 41.4,18.16 38.84,18.16 37.9,19.11 25.45,19.11 v25.08,18.73 25.06,18.76 22.35,18.76 22.1,18.5 22.1,17.14 21.43,16.47 20.07,16.47 18.98,16.47 17.06,14.54 v14.29,14.54 | v15.94,7.68 15.94,8 17.89,9.96 v19.3,9.96
A0  (via drill 0.39)
  Top 0.203: U1.22 31.52,12.47 33.31,12.47 33.59,12.19 v33.91,12.19
  Bottom 0.203: JP1.12 17.54,1.27 18.61,2.34 20.56,2.34 21.57,3.35 24.05,3.35 24.43,3.73 27.85,3.73 28.16,4.04 28.71,4.04 31.23,6.56 31.23,6.57 31.61,6.95 33.47,6.95 34.25,7.73 34.25,11.94 34,12.19 v33.91,12.19
A1  (via drill 0.39)
  Top 0.203: v32.41,13.21 32.34,13.13 U1.21
  Bottom 0.203: JP1.11 20.07,1.27 21.74,2.95 24.22,2.95 24.6,3.33 28.02,3.33 28.32,3.63 28.88,3.63 30.45,5.21 33.85,5.21 34.65,6.02 34.65,12.47 34.17,12.95 32.67,12.95 v32.41,13.21
A2  (via drill 0.39)
  Top 0.203: U1.20 31.4,13.91 31.52,13.92 32.76,13.92 33.02,13.65 v33.34,13.65
  Bottom 0.203: JP1.10 22.86,2.54 24.38,2.54 24.77,2.92 28.19,2.92 28.49,3.23 29.05,3.23 30.6,4.78 34.19,4.78 35.06,5.65 35.06,12.63 34.3,13.4 33.59,13.4 v33.34,13.65
A3  (via drill 0.39)
  Top 0.203: v34.23,14.1 33.85,14.1 33.57,14.39 32.03,14.39 31.59,14.83 U1.19
  Bottom 0.203: JP1.9 24.13,1.63 25.02,2.52 28.36,2.52 28.66,2.82 29.22,2.82 30.77,4.37 34.35,4.37 35.47,5.48 35.47,12.85 35.1,13.21 35.1,13.23 v34.23,14.1
A4  (via drill 0.39)
  Top 0.203: v35.24,14.1 34.49,14.85 32.54,14.85 31.72,15.68 U1.18
  Bottom 0.203: JP1.8 27.69,1.27 28.83,2.41 29.38,2.41 30.93,3.96 34.54,3.96 35.92,5.33 35.92,13.52 35.33,14.1 v35.24,14.1
A5  (via drill 0.39)
  Top 0.203: U1.12 34.92,17.16 35.18,16.9 35.18,15.95 36.26,14.87 v36.58,14.87
  Bottom 0.203: v36.58,14.87 36.58,15.06 36.39,15.06 36.39,14.86 36.32,14.8 36.32,5.08 34.8,3.56 31.1,3.56 29.67,2.12 29.67,1.27 JP1.7
BACKLITE  (via drill 0.39)
  Top 0.203: R13.8 28.09,12.74 Q1.1 29.31,13.83 v30.28,13.83 | v40.89,3.37 40.88,3.36 U1.41
  Bottom 0.203: v30.28,13.83 31.36,13.83 31.93,14.4 32.44,14.4 33.33,15.29 34.69,15.29 35.98,16.58 36.51,16.58 37.28,15.8 37.28,13.66 36.77,13.14 36.77,4.76 38.16,3.37 v40.89,3.37
BOOT0  (via drill 0.39)
  Top 0.178: v41.63,19.56 41.73,19.56 U1.4
  Bottom 0.178: v41.63,19.56 41.09,20.1 39.12,20.1 38.73,20.5 22.99,20.5
  Bottom 0.203: SW1.B' SW1.B 5.51,3.65 3.3,5.85 3.3,7.81 2.54,8.57 2.54,10.99 | 22.99,20.5 22.58,20.5 22.2,20.12 10.21,20.12 4.95,20.12 4.84,20.01 4.84,18.8 4.43,18.4 4.43,17.58 3.35,16.5 3.35,15.09 2.54,14.28 2.54,10.99 | TP1.P$1 2.34,11.19 2.54,10.99
D1  (via drill 0.39)
  Top 0.203: v40.64,19.43 40.66,19.45 40.88,19.45 U1.5
  Bottom 0.203: SW5.B' 9.17,11.14 8.03,11.14 7.25,10.36 SW5.B 4.67,11.58 4.04,11.58 3.05,12.57 3.05,14.17 3.76,14.88 3.76,16.33 4.84,17.41 4.84,18.23 5,18.39 10.27,18.39 11.14,19.27 22.9,19.27 23.26,19.62 38.35,19.62 39.26,18.72 39.93,18.72 v40.64,19.43
D2  (via drill 0.39)
  Top 0.203: U1.6 40.03,19.01 v39.65,19.4
  Bottom 0.203: v39.65,19.4 39.19,19.4 38.51,20.08 22.83,20.08 22.45,19.7 9.81,19.7 SW3.B SW3.B'
D5
  Top 0.203: JP3.10 39.12,21.59 37.48,19.96 U1.9
D6
  Top 0.203: U1.10 36.63,21.01 36.83,21.21 JP3.9
D9
  Top 0.203: U1.13 34.09,21.41 34.1,21.4 JP3.8
D10
  Top 0.203: JP3.7 31.75,21.54 33.23,20.08 U1.14
D11
  Top 0.203: U1.15 32.38,19.18 29.97,21.59 JP3.6
D12
  Top 0.203: JP3.5 26.67,20.83 27.43,20.07 30.1,20.07 30.61,19.56 30.61,17.41 U1.16
D13  (via drill 0.39)
  Top 0.203: 30.15,19.37 29.91,19.61 27.11,19.61 25.12,21.59 JP3.4 | R10.1 5.3,21.64 v4.64,21.64
  Top 0.254: U1.17 30.43,16.53 30.15,16.81 30.15,19.37
  Bottom 0.203: v4.64,21.64 10.1,21.64 11.22,20.52 22.03,20.52 23.1,21.59 JP3.4
D+  (via drill 0.39)
  Top 0.203: v8.39,10.42 8.07,10.11 7.44,10.11 6.87,10.68 X3.B6 5.33,10.68 5.33,11.43 5.58,11.67 X3.A6 | v27.34,7.02 27.79,7.02 28.04,7.28 28.04,8.55 28.38,8.88 29.26,8.88 30.95,10.58 U1.24
  Bottom 0.203: v8.39,10.42 8.39,10.04 10.04,8.39 10.04,7.57 11.51,6.1 23.13,6.1 25.61,8.58 26.23,8.58 26.64,8.17 26.64,7.78 27.34,7.09 v27.34,7.02
D-  (via drill 0.39)
  Top 0.203: X3.A7 7.11,11.18 7.11,11.23 | v7.49,11.61 7.11,11.23 | X3.B7 7,12.18 7.11,12.06 7.11,11.23 | U1.23 30.81,11.35 29.83,10.37 29.83,10.33 28.85,9.35 28.17,9.35 27.32,8.51 v27.32,8.06
  Bottom 0.203: v27.32,8.06 26.31,9.08 25.54,9.08 23,6.54 11.68,6.54 10.48,7.75 10.48,11.17 10.1,11.55 7.56,11.55 v7.49,11.61
EN  (via drill 0.39)
  Top 0.203: U2.3 17.8,8.86 R7.1 17.82,8.41 18.35,7.87 v18.67,7.87 | JP3.2 18.48,21.02 18.48,16.83 19.94,15.37 v19.94,15.24
  Bottom 0.203: v19.94,15.24 20.55,14.62 20.55,9.29 19.14,7.87 v18.67,7.87
GND  (via drill 0.39)
  Top 0.178: X2.4 22.21,17.15
  Top 0.203: CONN1.1 24.7,9.93 24.77,9.87 | C7.2 29.46,16.77 30.35,15.88 v30.35,15.24 | X2.6 21.71,17.4 X2.THERMAL 21.11,17.4 20.71,17 X2.1
  Top 0.254: U1.63 32.36,17.41 32.35,17.4 33.78,17.4 34.54,16.64 34.54,15.88 36.26,14.16 38.35,14.16 v38.35,14.8 | C5.2 24.93,4.38 | U2.2 15.42,8.39 | 23.62,15.94 23.62,14.61 23.68,14.55
  Top 0.305: U4.7 27,17.01 C9.2 | CONN1.MT1 22,13.74 21.84,13.59 21.84,10.16 v22.16,9.84 | C5.2 23.5,4.32 C12.2 | U4.1 23.87,16.19 23.62,15.94 | SW2.A 13.9,6.41 C4.2
  Top 0.406: X3.B1A12 6.95,8.23 R5.1 | X3.A1B12 6.63,14.63 7.62,15.62 7.62,16.26 7.87,16.51 9.65,16.51 9.79,16.37 X1.1 | C1.2 16.19,14.02 15.67,14.54 R4.1 | U2.2 15.42,8.37 14.8,7.75 13.27,7.75 12.82,8.2 C6.2 | U3.2 18.11,13.29 C2.2
  other vias: 43.81,5.71 43.81,8 43.88,10.54 43.81,12.19 43.81,14.61 43.69,16.89 42.29,15.56 40.2,16.07 34.04,16 38.73,5.84 41.4,5.84 41.91,11.3 41.78,8.51 39.5,8 10.1,6.48 13.08,14.1 27.88,5.52 41.53,13.72 11.49,7.75 8.7,7.62 9.14,20.89 8.38,16.76 13.21,16.89 14.48,16.89 3.24,11.24 4.19,13.78 24.96,13.84 22.23,15.43 24.51,9.02 20.32,4.25 20.45,7.94 21.4,12.83 37.59,7.62 15.43,11.56 11.18,12.38 11.49,18.54 17.84,3.17 33.21,17.4 36.51,17.34 12.76,5.33
  pour Top: 0,22.86 45.72,22.86 45.72,0 0,0
  pour Bottom: 0,22.86 45.72,22.86 45.72,0 0,0
I2CTFT_POWER  (via drill 0.39)
  Top 0.203: v25.78,6.98 26.23,6.98 26.64,7.4 26.64,8.4 28.09,9.85 R13.5 28.49,10.34 28.66,10.34 30.35,12.02 v30.35,12.76 | v19.11,3.71 19.11,4.42 U5.3 | v36.29,15.84 35.8,16.33 35.78,16.32 U1.11
  Bottom 0.203: v25.78,6.98 25.65,6.98 23.75,5.08 19.97,5.08 19.11,4.22 v19.11,3.71 | v30.35,12.76 30.88,12.76 32.01,13.89 32.56,13.89 33.45,14.78 35.16,14.78 36.23,15.84 v36.29,15.84
IO34_DBLTAP
  Top 0.203: C5.1 R17.2 28.11,4.32 29.01,5.19 30.32,5.19 30.48,5.35 30.48,6.27 U1.29
LEDK  (via drill 0.39)
  Top 0.203: v26.54,14.1 26.54,14.14 25.72,14.14 24.56,15.3 R9.2
  Bottom 0.203: DISP1.11 26.54,14.06 v26.54,14.1
MISO
  Top 0.254: U1.33 34.05,4.4 34.05,3.41 36.2,1.27 JP1.4
MOSI  (via drill 0.39)
  Top 0.203: U1.31 32.51,4.56 32.51,4.85 33.53,5.87 33.53,7.56 32.62,8.46 32.51,8.36 v32.45,8.36
  Top 0.254: v32.7,2.41 32.38,2.73 U1.31
  Bottom 0.203: v32.45,8.36 32.34,8.46 DISP1.3
  Bottom 0.254: v32.7,2.41 33.15,2.41 JP1.5
N$1
  Top 0.203: R2.1 4.42,4.24 3.2,5.46 CHG.C
N$2
  Top 0.203: R9.1 26.23,15.3 26.46,15.07 27.12,14.54 Q1.3
N$3  (via drill 0.39)
  Top 0.203: v16.76,16.32 17.02,16.32 17.16,16.18 U3.1 | R2.2 7.75,5.12 v7.75,5.27 | v4.51,12.76 4.11,12.36 v4.11,9.81
  Bottom 0.203: v16.76,16.32 16.76,16.26 16.57,16.07 12.71,16.07 9.78,13.14 4.9,13.14 v4.51,12.76 | v7.75,5.27 6.87,6.15 4.77,6.15 4.25,6.67 4.25,9.81 v4.11,9.81
N$4
  Top 0.203: U3.5 16.46,17.56 15.67,16.77 R4.2
N$5
  Top 0.203: D3.A 2.92,17.53 4.93,19.53 R10.2
N$8  (via drill 0.39)
  Top 0.203: X3.A5 6.9,12.68 8.14,13.92 v8.14,14.11 | v7.18,16.95 6.25,16.95 R8.2
  Bottom 0.203: v7.18,16.95 7.06,16.84 7.06,14.68 7.63,14.11 v8.14,14.11
N$9
  Top 0.203: X3.B5 6.96,9.68 7.38,9.26 R5.2
NEOPIX
  Top 0.178: U1.28 29.58,7.14 LED1.1
NEOPIX_PWR
  Top 0.203: LED1.2 29.53,8.32 30.93,9.71 U1.25
RESET  (via drill 0.39)
  Top 0.203: SW2.B' 8.74,2.65 8.49,2.4 | 8.49,2.4 7.37,1.27 JP1.16 | SW2.B 14,4.26 C4.1 15.57,4.43 R1.1 15.62,2.4 | v30.48,1.97 30.16,1.97 29.73,2.4 15.62,2.4 | v44.32,3.13 44.17,3.29 44.28,3.29 U1.45 | 15.62,2.4 8.49,2.4
  Bottom 0.178: SW4.B' SW4.B
  Bottom 0.203: v30.48,1.97 30.48,2.24 31.38,3.15 33.11,3.15 33.76,2.5 43.72,2.5 44.32,3.1 v44.32,3.13 44.32,3.3 45.38,4.36 SW4.B
RX
  Top 0.254: U1.34 34.94,3.29 35.81,2.41 37.47,2.41 38.61,1.27 JP1.3
SCK  (via drill 0.39)
  Top 0.203: U1.32 33.23,4.91 | 33.23,4.91 | v32.83,9.27 32.83,8.95 33.93,7.85 33.93,5.61 33.23,4.91
  Top 0.254: U1.32 33.49,4.18 33.49,2.06 32.7,1.27 JP1.6
  Bottom 0.203: DISP1.4 29,8.95 31.94,8.95 32.26,9.27 v32.83,9.27
SCL  (via drill 0.39)
  Top 0.178: U4.4 23.28,18.31 22.93,17.96 | 22.93,17.96 v22.92,17.95 | CONN1.4 23.66,12.93 v23.05,12.32 | U1.8 38.34,20.17 38.7,20.54 39.81,20.54 40.03,20.77 41.08,20.77 JP3.11 | X2.7 21.21,18.9 21.37,19.05 22.43,19.05 22.93,18.54 22.93,17.96
  Top 0.203: U1.8 38.35,18.43 v38.35,17.4 | CONN1.4 25.02,12.93 25.6,12.35 25.6,12.05 26.02,11.64 R13.2
  Bottom 0.178: v23.05,12.32 22.92,12.45 22.92,13.95 23.48,14.51 23.88,14.51 25.84,16.48 25.84,16.68 25.21,17.32 23.56,17.32 v22.92,17.95
  Bottom 0.203: 25.84,16.68 27.75,18.59 37.17,18.59 37.17,18.58 37.56,18.58 38.19,17.95 38.19,17.57 v38.35,17.4
SDA  (via drill 0.39)
  Top 0.178: v23.88,13.84 23.18,13.84 | CONN1.3 23.85,11.93 23.48,11.57 22.85,11.57 22.35,12.06 22.35,12.71 23.18,13.53 23.18,13.84 | U1.7 39.19,18.81 38.84,19.15 38.84,19.75 39.24,20.16 39.96,20.16 40.16,20.34 42.16,20.34 43.4,21.59 JP3.12 | 23.18,13.84 23.18,16.37 | 23.18,16.37 | 23.18,16.37 23.18,17.12 23.71,17.66 U4.3 24.14,17.66 24.38,17.91 24.38,18.8 23.75,19.43 21.21,19.43 20.71,18.93 X2.8
  Top 0.203: U1.7 39.19,17.65 v39.5,17.34 | CONN1.3 25.03,11.93 26.12,10.84 R13.3
  Bottom 0.178: 28.08,18.17 23.88,13.97 v23.88,13.84
  Bottom 0.203: v39.5,17.34 39.37,17.34 38.7,16.67 38.11,16.67 38.11,16.68 37.67,17.12 37.67,17.89 37.39,18.17 28.08,18.17
TFT_CS  (via drill 0.39)
  Top 0.203: U1.38 38.34,5.07 37.38,6.02 35.6,6.02 35.15,6.47 35.15,8.35 34.35,9.15 34.35,10.61 33.22,11.74 v32.31,11.74
  Bottom 0.203: DISP1.7 29.55,11.26 30.08,10.73 31.3,10.73 v32.31,11.74
TFT_DC  (via drill 0.39)
  Top 0.203: v32.38,10.15 33.08,10.15 33.52,9.71 33.52,8.84 34.34,8.02 34.34,6.09 35.24,5.19 36.51,5.19 36.63,5.07 U1.36
  Bottom 0.203: DISP1.5 29.62,9.86 30.06,9.42 31.64,9.42 v32.38,10.15
TFT_RST  (via drill 0.39)
  Top 0.203: v32.96,10.99 32.96,10.92 33.95,9.93 33.95,8.99 34.75,8.19 34.75,6.3 35.43,5.61 36.94,5.61 37.48,5.07 U1.37
  Bottom 0.203: DISP1.6 29.55,10.56 30.19,9.93 31.14,9.93 32.19,10.99 v32.96,10.99
TX
  Top 0.254: U1.35 35.78,3.29 36.2,2.87 37.78,2.87 38.29,2.36 40.13,2.36 40.43,2.06 41.12,2.06 JP1.2
TXD0
  Top 0.203: U1.39 39.26,4.36 39.26,3.16 39.62,2.79 40.31,2.79 40.61,2.5 41.3,2.5 41.45,2.34 42.43,2.34 43.5,1.27 JP1.1
VBAT
  Top 0.305: Q3.3 10.21,12.75 11.81,14.35 11.81,15.59 X1.2 | U3.3 19.06,14.07 C3.1 | 20.2,14.41 21.21,15.42 X2.2 X2.3
  Top 0.406: X1.2 11.79,17.26 12.57,18.03 16,18.03 16.51,18.54 16.76,18.54 16.76,18.61 | 16.76,18.61 17.52,18.61 17.94,18.19 17.94,16.16 18.16,15.94 18.54,15.94 19.06,15.42 U3.3 19.06,14.64 19.28,14.41 20.2,14.41 | JP3.1 16.76,21.34 16.76,18.61
VBUS  (via drill 0.39)
  Top 0.203: CHG.A 1.84,6.28 4.23,6.28 4.23,6.63 | R12.2 4.56,6.3 4.23,6.63 | 4.23,6.63 4.17,6.69 4.17,8.8 4.61,9.25
  Top 0.254: X3.B4A9 6.15,8.97 5.83,8.97 5.56,9.25 4.87,9.25 | 4.87,9.25 4.61,9.25 | 4.87,9.25 4.87,11.59 5.32,12.05 5.32,13.45 5.7,13.83 X3.A4B9
  Top 0.305: X3.A4B9 6.78,13.83 8.39,15.44 v8.39,15.48 8.87,15.01 D4.A 9.52,11.72 9.52,9.21 Q3.1
  Top 0.406: JP3.3 19.24,19.24 19.24,18.67 v20,17.91 19.41,17.91 U3.4
  Bottom 0.406: v20,17.91 19.94,17.84 12.26,17.84 9.89,15.48 v8.39,15.48
VHI
  Top 0.203: U2.1 14.47,9.52 | 19.38,8.88 R7.2
  Top 0.305: D4.C 12.63,12.37 12.82,12.19 C6.1 | C6.1 12.25,10.72 11.16,9.64 Q3.2 | C6.1 13.66,10.72 14.47,9.92 U2.1 | 14.47,9.52 14.86,9.91 18.35,9.91 18.57,9.68 18.57,9.65 19.35,8.88 19.38,8.88
  Top 0.406: U5.1 19.59,7.11 19.59,8.8 R7.2
VSENSOR  (via drill 0.48)
  Top 0.305: U4.2 24.39,17.01 v24.86,16.54 | v24.86,16.54 25.24,16.92 25.24,17.24 25.66,17.66 U4.6 U4.5 | U4.8 25.04,16.36 v24.86,16.54 | U5.5 23.24,6.47 | 23.24,6.47 C12.1 23.79,6.41 24.23,5.97 C11.1 | 23.24,10.41 23.81,10.99 24.49,10.99 CONN1.2 | 23.24,6.47 23.24,7.81 | v23.15,10.79 23.24,10.89 23.24,10.41 | 23.24,7.81 25.41,7.81 27.24,9.65 27.24,10.23 27.85,10.84 R13.6 R13.7 27.6,11.64 27.25,11.99 v27.25,13.26 | 23.24,10.41 23.24,7.81
  Bottom 0.305: v23.15,10.79 23.15,11.12 22.32,11.95 22.32,14 23.27,14.95 23.69,14.95 24.96,16.22 24.96,16.45 v24.86,16.54 | DISP1.10 27.36,13.36 v27.25,13.26 26.24,13.26 25.81,13.68 25.81,14.4 26.24,14.83 26.84,14.83 26.93,14.74 28.77,14.74 DISP1.12

### Text on the board
Pinguin_tBackup: SDA | BAT | EN | USB | 13 | 12 | 11 | 10 | 9 | 6 | 5 | SCL | #13 | Neo | Reset | QTI2C | RST | 3V | 3V | GND | A0 | A1 | A2 | A3 | A4 | A5 | SCK | MO | MI | RX | TX | DB
Pinguin_bBackup: D2 | D1 | ESP32-S3 Rev / TFT Feather | Reset | D0